# Altium schematic sheet Motors.SchDoc
size A
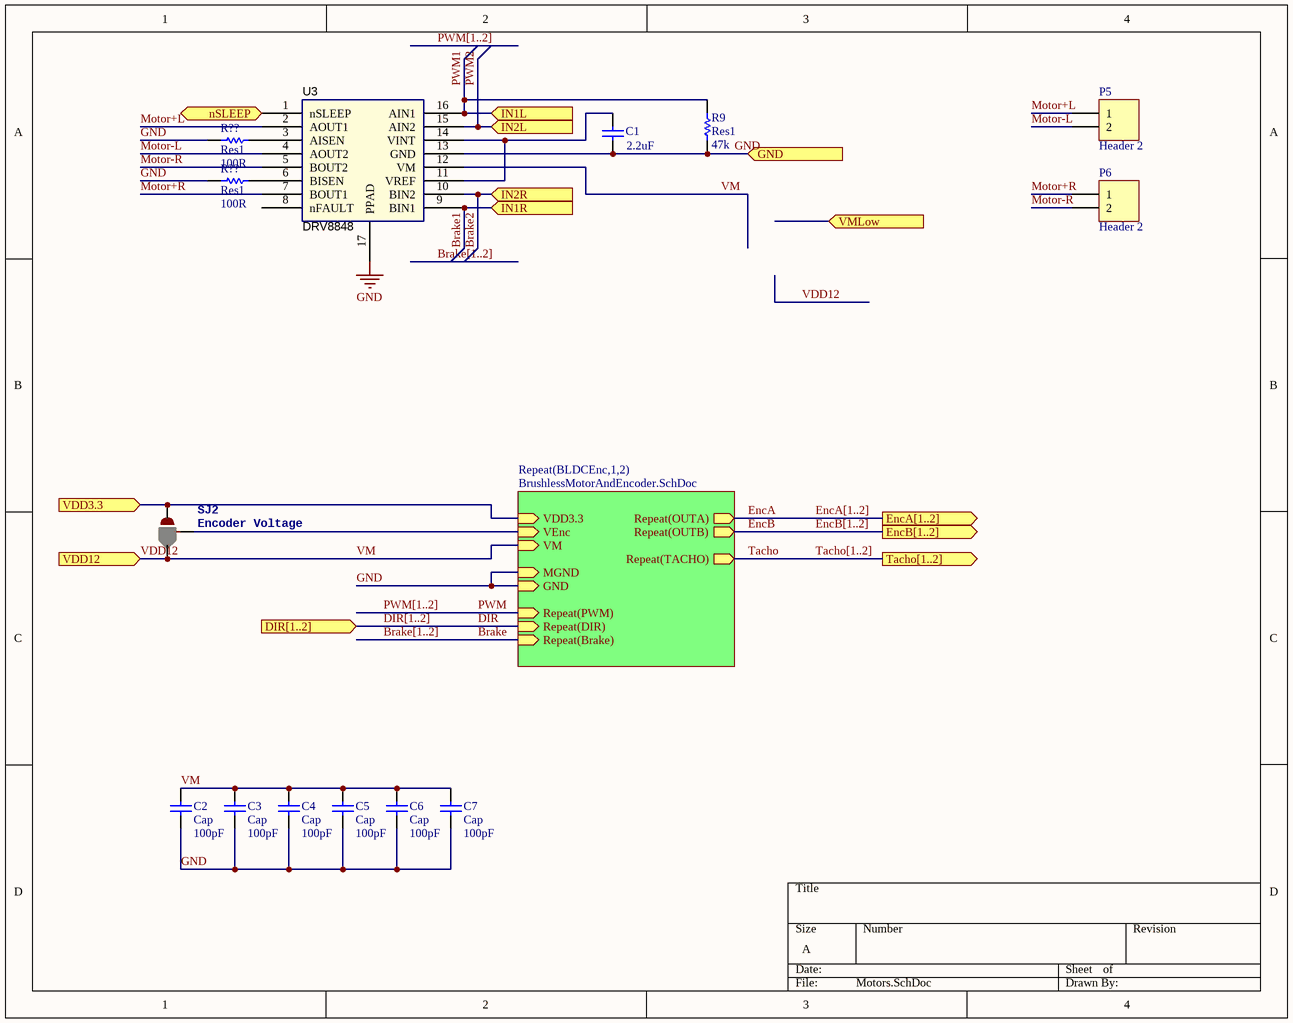
[diagram p0: Motors.SchDoc]

## Parts
(Parts that share a designator on the sheet are numbered #1, #2 ... from top to bottom, then left to right.)
C1  value 2.2uF  [RAD-0.3]
C2  Cap  value 100pF  [RAD-0.3]
C3  Cap  value 100pF  [RAD-0.3]
C4  Cap  value 100pF  [RAD-0.3]
C5  Cap  value 100pF  [RAD-0.3]
C6  Cap  value 100pF  [RAD-0.3]
C7  Cap  value 100pF  [RAD-0.3]
P5  Header 2  [HDR1X2]
P6  Header 2  [HDR1X2]
R9  Res1  value 47k  [AXIAL-0.3]
R??#1  Res1  value 100R  [AXIAL-0.3]
R??#2  Res1  value 100R  [AXIAL-0.3]
SJ2  Encoder Voltage  [PAD-JUMPER-3-2OF3_NC_BY_PASTE_YES_SILK_FULL_BOX]
U3  DRV8848  [PW0016S]

## Sub-sheets
Repeat(BLDCEnc,1,2) = BrushlessMotorAndEncoder.SchDoc: Repeat(OUTB) (out), MGND (in), Repeat(TACHO) (out), GND (in), VM (in), Repeat(Brake) (in), Repeat(PWM) (in), Repeat(DIR) (in), Repeat(OUTA) (out), VEnc (in), VDD3.3 (in)

## Ports
DIR[1..2] (in), EncA[1..2] (out), EncB[1..2] (out), GND (in), IN1L (in), IN1R (in), IN2L (in), IN2R (in), nSLEEP (in), Tacho[1..2] (out), VDD3.3 (in), VDD12 (in), VMLow (in)

## Nets
GND: C1.1 C2.1 C3.1 C4.1 C5.1 C6.1 C7.1 R9.1 R??#1.1 R??#2.1 U3.13(GND) U3.17(PPAD) ; port GND, sheet Repeat(BLDCEnc,1,2)/MGND, sheet Repeat(BLDCEnc,1,2)/GND
Brake: sheet Repeat(BLDCEnc,1,2)/Repeat(Brake)
Brake1: U3.9(BIN1) ; port IN1R
Brake2: U3.10(BIN2) ; port IN2R
DIR: sheet Repeat(BLDCEnc,1,2)/Repeat(DIR)
EncA: sheet Repeat(BLDCEnc,1,2)/Repeat(OUTA)
EncB: sheet Repeat(BLDCEnc,1,2)/Repeat(OUTB)
Motor+L: P5.1 U3.2(AOUT1)
Motor+R: P6.1 U3.7(BOUT1)
Motor-L: P5.2 U3.4(AOUT2)
Motor-R: P6.2 U3.5(BOUT2)
nSLEEP: U3.1(nSLEEP) ; port nSLEEP
PWM: sheet Repeat(BLDCEnc,1,2)/Repeat(PWM)
PWM1: R9.2 U3.16(AIN1) ; port IN1L
PWM2: U3.15(AIN2) ; port IN2L
Tacho: sheet Repeat(BLDCEnc,1,2)/Repeat(TACHO)
VDD3.3: SJ2.1 ; port VDD3.3, sheet Repeat(BLDCEnc,1,2)/VDD3.3
VDD12: C2.2 C3.2 C4.2 C5.2 C6.2 C7.2 SJ2.3 U3.12(VM) ; port VDD12, sheet Repeat(BLDCEnc,1,2)/VM  [also labelled VM]
NetC1_2: C1.2 U3.11(VREF) U3.14(VINT)
NetR??#1_2: R??#1.2 U3.3(AISEN)
NetR??#2_2: R??#2.2 U3.6(BISEN)
NetSJ2_2: SJ2.2 ; sheet Repeat(BLDCEnc,1,2)/VEnc

Not connected (* = marked no-connect by the designer): U3 8(nFAULT)

## Buses and harness runs
bus Brake[1..2]
bus DIR[1..2] = port DIR[1..2]
bus EncA[1..2] = port EncA[1..2]
bus EncB[1..2] = port EncB[1..2]
bus PWM[1..2]
bus Tacho[1..2] = port Tacho[1..2]

## Library data of the parts
C1-C7 = Cap: Capacitor; Published: 8-Jun-2000; LatestRevisionDate: 17-Jul-2002; LatestRevisionNote: Re-released for DXP Platform.; PackageReference: RAD-0.3; Publisher: Altium Limited; PackageDescription: Radial Cap, Thru-Hole; 2 Leads; 0.3 in Pin Spacing
P5 P6 = Header 2: Header, 2-Pin; LatestRevisionDate: 17-Jul-2002; LatestRevisionNote: Re-released for DXP Platform.; Publisher: Altium Limited
R9 R??#1 R??#2 = Res1: Resistor; Published: 8-Jun-2000; LatestRevisionDate: 17-Jul-2002; LatestRevisionNote: Re-released for DXP Platform.; PackageReference: AXIAL-0.3; Publisher: Altium Limited; PackageDescription: Axial Device, Thru-Hole; 2 Leads; 0.3 in Pin Spacing
SJ2 = JUMPER-PAD-3-2OF3_NC_BY_PASTE
U3 = DRV8848PWP: IC MOTOR DRIVER PAR 16HTSSOP; Manufacturer: Used in BOM report; Manufacturer: Texas Instruments; SymbolVersion: use current date i.e. 2008-05-20; SymbolCreator: Use a-id; CompType: Used in some BOM reports.  Useful for finding later.; U/M: EA, IN, or GM; MountType: SMT, TH, or N/A; RoHS: Used in BOM report.  Use Y or N.; PartNumber: Used in BOM report; PackageReference: PWP0016; ComponentLink1Description: Datasheet Link; Alternate PartNumber: -; Alternate Manufacturer: -; Supplier 1: Digi-key; Supplier Part Number 1: 296-38514-5-ND; PartNumber: DRV8848PWP